# EAGLE design PN532NFCExtAnt (EAGLE 7.7.0)
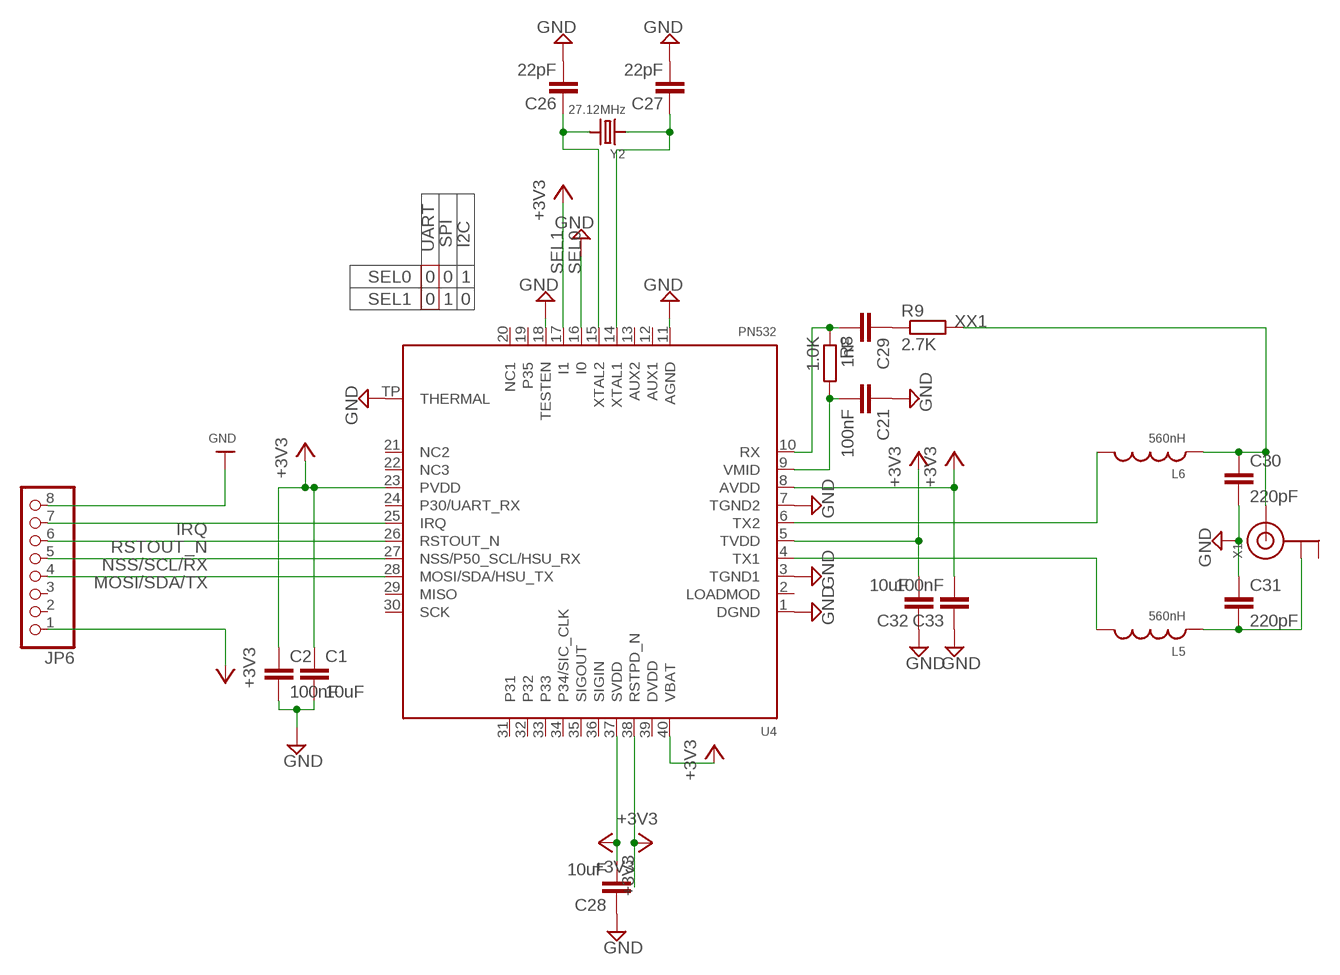
[diagram p0: schematic, sheet 1]

## Parts
C1  10uF  C-EUC0805  [C0805]
C2  100nF  C-EUC0805  [C0805]
C21  100nF  C-EUC0603  [C0603]
C26  22pF  CAP0603-CAP  [0603-CAP]
C27  22pF  CAP0603-CAP  [0603-CAP]
C28  10uF  C-EUC0805  [C0805]
C29  1nF  C-EUC0603  [C0603]
C30  220pF  C-EUC0603  [C0603]
C31  220pF  C-EUC0603  [C0603]
C32  10uF  C-EUC0805  [C0805]
C33  100nF  C-EUC0805  [C0805]
JP6  HEADER-1X8ROUND  [1X08_ROUND]
L5  560nH  INDUCTOR0805  [0805@1]
L6  560nH  INDUCTOR0805  [0805@1]
R8  1.0K  R-EU_R0603  [R0603]
R9  2.7K  R-EU_R0603  [R0603]
U4  PN532  [HVQFN40-6X6]
X1  ANTENNA_U.FL  [U.FL]
Y2  27.12MHz  CRYSTALTHIN  [CRYSTAL_3.2X2.5]

## Nets
+3V3: C1.1 C2.1 C28.2 C32.2 C33.2 JP6.1 U4.5(TVDD) U4.8(AVDD) U4.23(PVDD) U4.37(SVDD) U4.38(RSTPD_N) U4.40(VBAT)
CON1: C31.2 L5.1 X1.1(GND)
GND: C1.2 C2.2 C21.1 C26.1 C27.1 C28.1 C30.2 C31.1 C32.1 C33.1 JP6.8 U4.1(DGND) U4.3(TGND1) U4.7(TGND2) U4.11(AGND) U4.18(TESTEN) U4.TP(THERMAL)
IRQ: JP6.7
MOSI/SDA/TX: JP6.4
N$6: L5.2 U4.4(TX1)
N$15: L6.2 U4.6(TX2)
N$16: C29.1 R9.1
N$47: C27.2 U4.14(XTAL1) Y2.1
N$48: C26.2 U4.15(XTAL2) Y2.2
N$49: C21.2 R8.2 U4.9(VMID)
N$50: C29.2 R8.1 U4.10(RX)
NSS/SCL/RX: JP6.5
RSTOUT_N: JP6.6
SEL0: U4.16(I0) ; supply symbol labelled GND
SEL1: U4.17(I1)
XX1: C30.1 L6.1 R9.2 X1.3(SIGNAL)
Unconnected: JP6.2 JP6.3 U4.2(LOADMOD) U4.12(AUX1) U4.13(AUX2) U4.19(P35) U4.20(NC1) U4.21(NC2) U4.22(NC3) U4.24(P30/UART_RX) U4.25(IRQ) U4.26(RSTOUT_N) U4.27(NSS/P50_SCL/HSU_RX) U4.28(MOSI/SDA/HSU_TX) U4.29(MISO) U4.30(SCK) U4.31 U4.32 U4.33 U4.34(P34/SIC_CLK) U4.35(SIGOUT) U4.36(SIGIN) U4.39(DVDD) X1.2(GND)

## Notes on the sheet
- UART | SPI | I2C
- SEL0 | 0 | 0 | 1
- SEL1 | 0 | 1 | 0

## Library data of the parts
C1 C2 C21 C28-C33 = rcl:C-EU: CAPACITOR, European symbol
C26 C27 = SparkFun:CAP: Capacitor Standard 0603 ceramic capacitor, and 0.1" leaded capacitor.
JP6 = microbuilder:HEADER-1X8: PIN HEADER
L5 L6 = microbuilder:INDUCTOR: Inductors 0603: 10nH Ceramic Inductor - microwire antenna/RF (Digikey: 712-1434-2-ND) 0805: 560nH Ceramic Inductor - RF (Digikey: 553-1047-1-ND) 1007 (2518 Metric) SMT: 10µH 10% 250mOhm 820mA 1007 Inductor (Digikey: 587-2189-1-ND) 22µH 10% 500mOhm 580mA 1007 Inductor (Digikey: 587-2190-1-ND) 47µH 10% 950mOhm 420mA 1007 Inductor (Digikey: 587-2191-1-ND) 47µH 5% 100mOhm 1A 1008 Inductor (Digikey: 732-1816-1-ND)
R8 R9 = rcl:R-EU_: RESISTOR, European symbol
U4 = microbuilder:PN532: PN532 - Near Field Communication (NFC) controller Highly integrated transceiver module for contactless communication at 13.56 MHz (14443A/MIFARE, FeliCa, I4443B)
X1 = adafruit:ANTENNA_U.FL: U.FL Antenna Connector
Y2 = microbuilder:CRYSTAL: Crystals HC49UP - Surface Mount Crystal 4.0MHz 18pF +/-30ppm Surface Mount Crystal [Digikey: 535-9857-1-ND] 12.0 MHz Surface Mount Crystal [Digikey: 535-9869-6-ND] 25.0 MHz Surface Mount Crystal [Digikey: 535-9078-1-ND] 3.2 x 2.5mm - MEMs SMT Crystal 12.0 MHz 8pF 15ppm 3.2 x 2.5mm Crystal [Digikey: 644-1047-1-ND] 16.0 MHz 8pF 15ppm 3.2 x 2.5mm Crystal [Digikey: 644-1049-1-ND] 16.0 MHz 10pF 10ppm 3.2 x 2.5mm Crystal [Digikey: 644-1100-1-ND] 27.12 MHz 18pF 30ppm 3.2 x 2.5mm Crystal [Digikey: 887-1424-1-ND] 4.9 x 1.8mm - MEMs SMT Crystal 32.768 KHz 12.5pF 20ppm 4.9 x 1.8mm Crystal [Digikey: SE2415CT-ND] Cylinder 32.768KHz Cylinder Crystal

## Net classes
1 Ground: width 0.61 mm, clearance 0.254 mm

## Board
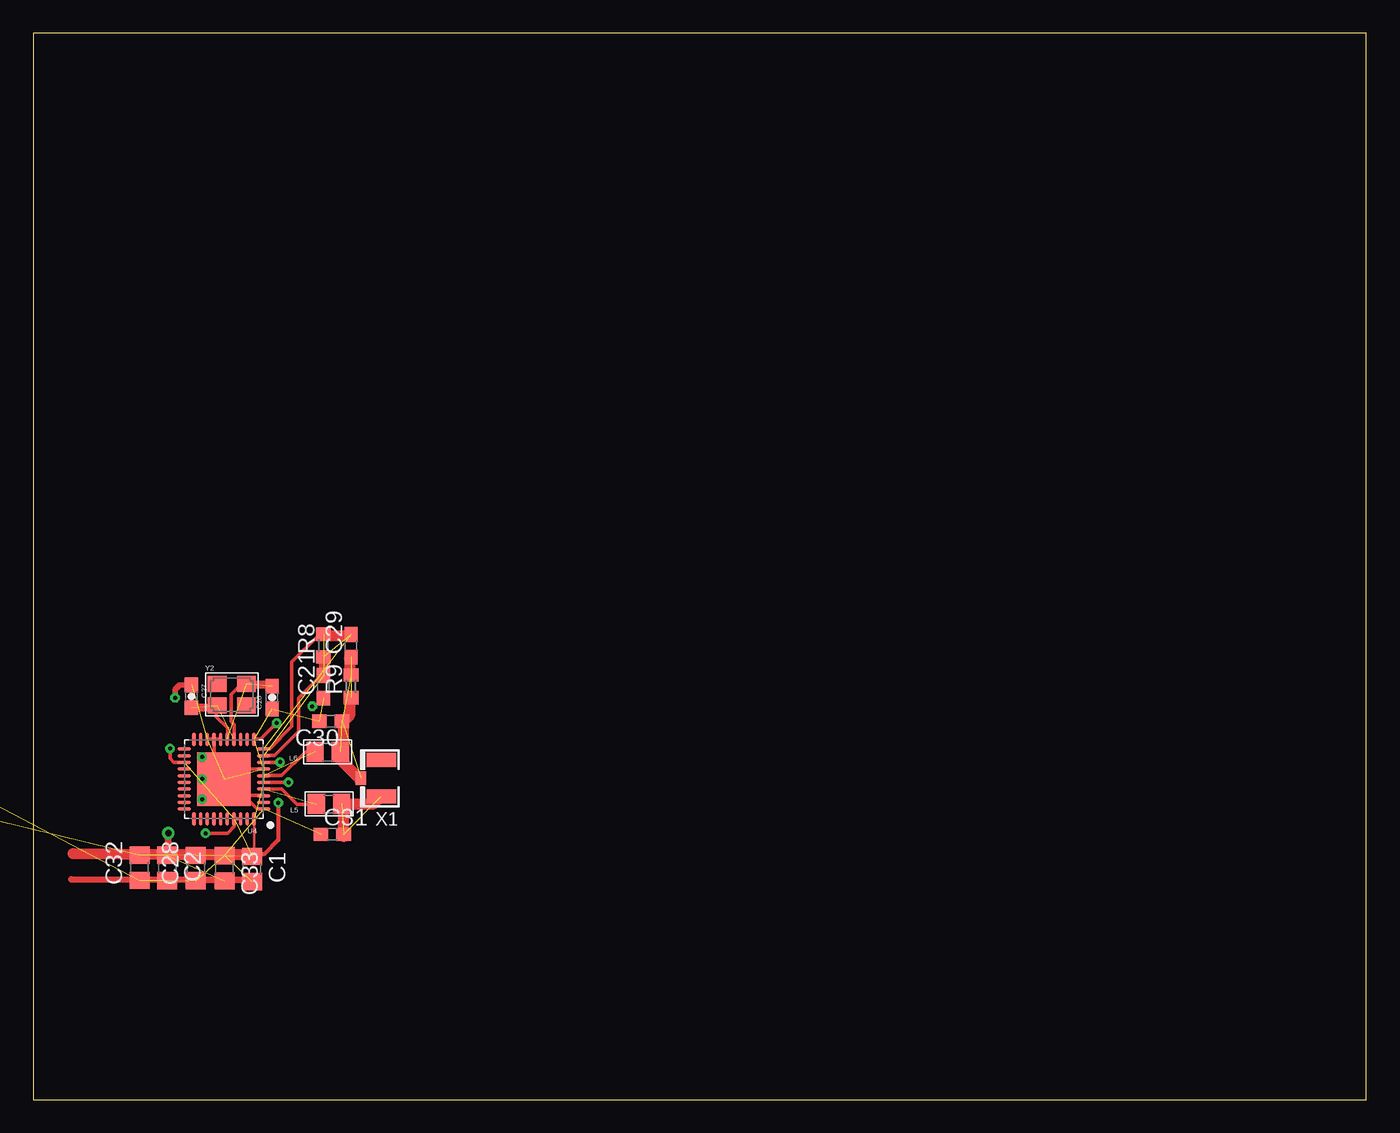
[diagram p1: board, top side]
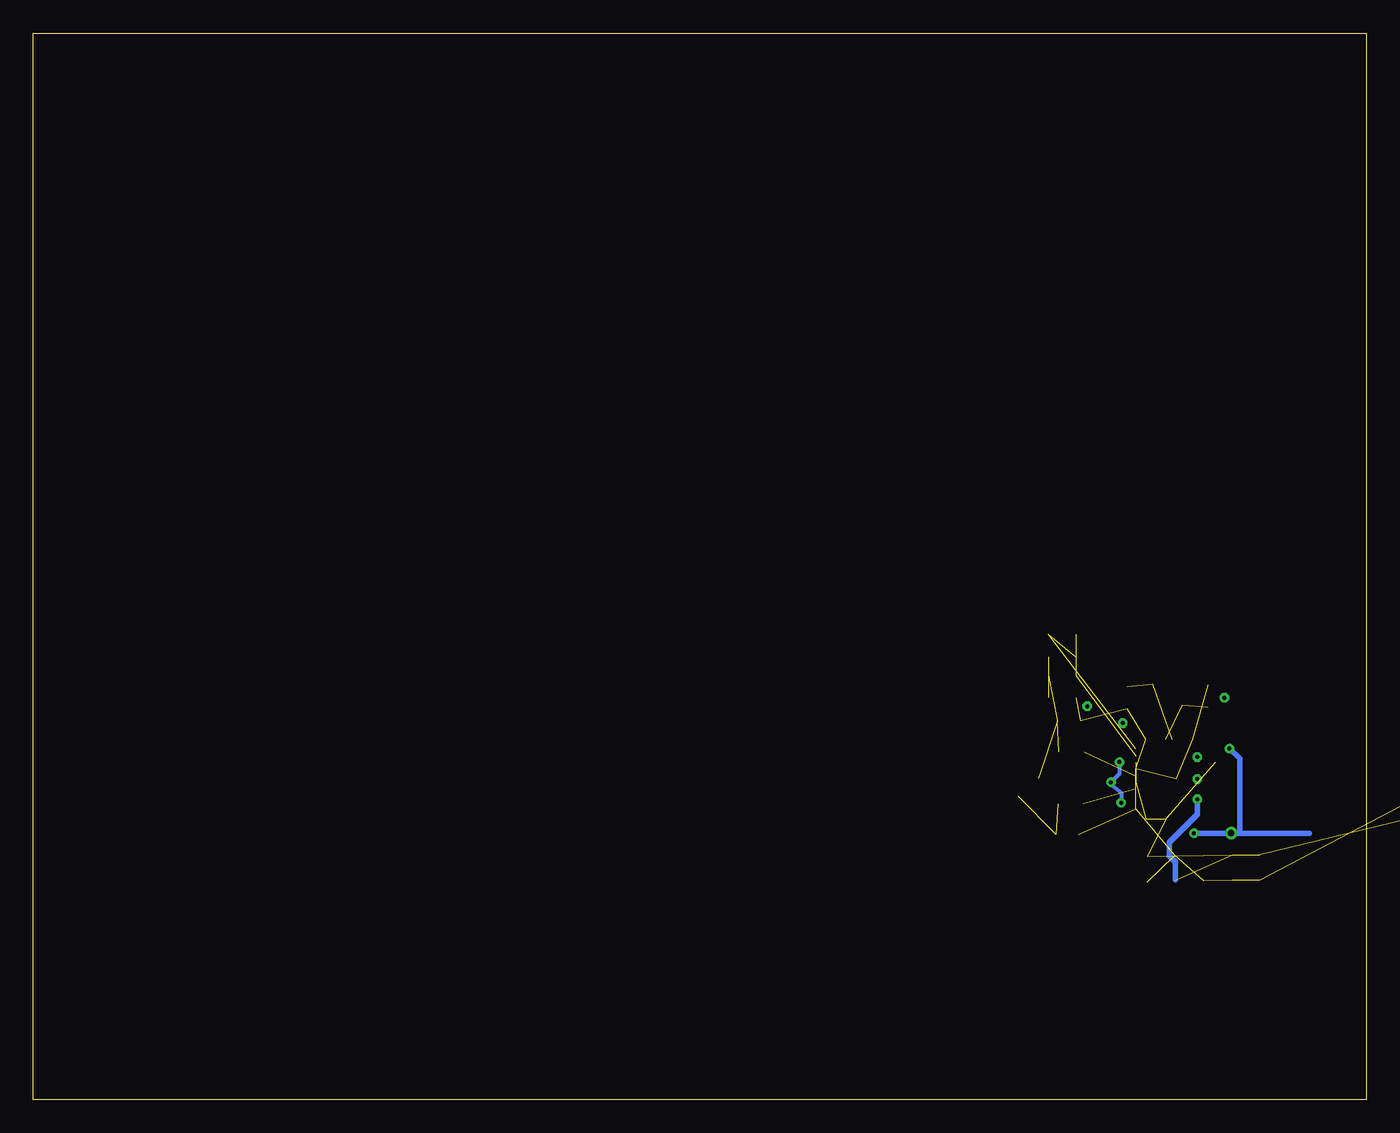
[diagram p2: board, bottom side, seen from below]

Size 100 x 80 mm. Coordinates in mm from the lower left corner, seen from the top.
Outline: 0,0 100,0 100,80 0,80 0,0
Copper layers (1*16): Top 0.035mm / dielectric 1.5mm / Bottom 0.035mm
Design rules "default": minimum track width 10mil, minimum drill 24mil, track to track 8mil, track to pad 8mil, pad to pad 8mil, via to via 8mil, smd to smd 8mil, copper to edge 40mil, drill to drill 8mil, minimum pad ring 10mil, minimum via ring 8mil, stop-mask expansion 4mil, vias tented up to drill 0mil, thermal gap 10mil

### Footprints (pad centres in the part's own frame; a part is rotated, then mirrored left to right if it is on the bottom)
C0805 = smd 1.3 x 1.5: 1 -0.95,0; 2 0.95,0
C0603 = smd 1.1 x 1: 1 -0.85,0; 2 0.85,0
0603-CAP = smd 1.1 x 1: 1 -0.85,0; 2 0.85,0
1X08_ROUND = drill 1 pad 1.676: 1 -8.89,0; 2 -6.35,0; 3 -3.81,0; 4 -1.27,0; 5 1.27,0; 6 3.81,0; 7 6.35,0; 8 8.89,0
0805@1 = smd 1.3 x 1.5: 1 -0.95,0; 2 0.95,0
R0603 = smd 1 x 1.1: 1 -0.85,0; 2 0.85,0
HVQFN40-6X6 = smd 1 x 0.25: 1 -2.99,2.25; 2 -2.99,1.75; 3 -2.99,1.25; 4 -2.99,0.75; 5 -2.99,0.25; 6 -2.99,-0.25; 7 -2.99,-0.75; 8 -2.99,-1.25; 9 -2.99,-1.75; 10 -2.99,-2.25; 21 2.99,-2.25; 22 2.99,-1.75; 23 2.99,-1.25; 24 2.99,-0.75; 25 2.99,-0.25; 26 2.99,0.25; 27 2.99,0.75; 28 2.99,1.25; 29 2.99,1.75; 30 2.99,2.25 | smd 0.25 x 1: 11 -2.25,-2.99; 12 -1.75,-2.99; 13 -1.25,-2.99; 14 -0.75,-2.99; 15 -0.25,-2.99; 16 0.25,-2.99; 17 0.75,-2.99; 18 1.25,-2.99; 19 1.75,-2.99; 20 2.25,-2.99; 31 2.25,2.99; 32 1.75,2.99; 33 1.25,2.99; 34 0.75,2.99; 35 0.25,2.99; 36 -0.25,2.99; 37 -0.75,2.99; 38 -1.25,2.99; 39 -1.75,2.99; 40 -2.25,2.99 | smd 4 x 4: TP 0,0
U.FL = smd 2.2 x 1.05: 1 0,1.375; 2 0,-1.375 | smd 0.8 x 1: 3 1.525,0
CRYSTAL_3.2X2.5 = smd 1.4 x 1.2: 1 -1.1,-0.8; 2 1.1,0.8; GND1 -1.1,0.8; GND2 1.1,-0.8

### Placement (x,y rotation side)
C1  16.41,17.29 270 top
C2  10.05,17.38 270 top
C21  21.77,30.97 90 top
C26  17.91,30.16 90 top
C27  11.87,30.25 270 top
C28  12.2,17.38 90 top
C29  23.84,34.05 90 top
C30  22.31,28.4 180 top
C31  22.43,19.89 0 top
C32  7.97,17.39 90 top
C33  14.34,17.36 270 top
JP6  -22.86,27.94 0 top  (outside the outline)
L5  22.18,22.16 180 top
L6  22.09,26.07 180 top
R8  21.77,34.05 90 top
R9  23.84,31 90 top
U4  14.3,24.04 180 top
X1  26.11,24.11 180 top
Y2  14.89,30.39 0 top

### Tracks (layer width: path | path; a pad name or v marks a point on that pad's centre or on a via)
+3V1  (via drill 0.3, 0.5)
  Top 0.2: 16.61,18.4 16.57,18.18 16.57,21.06
  Top 0.254: 11.32,25.3 10.53,25.3 10.26,25.58 v10.26,26.34 | v12.92,19.99 14.57,19.99 15.07,20.48 15.07,21.06 15.57,21.06 | 17.3,23.8 v19.14,23.8 | 17.3,25.3 18.62,25.3 v18.51,25.32
  Top 0.305: v18.38,22.27 18.38,19.48 17.3,18.4 16.61,18.4 | v19.14,23.8 19.27,23.8 | 2.88,18.46 2.98,18.46
  Top 0.5: v10.13,19.99 10.13,18.4
  Top 0.813: 2.98,18.46 10.13,18.4 16.61,18.4
  Bottom 0.305: v18.38,22.27 18.38,23.04 19.02,23.54 19.27,23.8 v19.14,23.8 18.51,24.43 v18.51,25.32
  Bottom 0.406: 4.29,19.99 9.49,19.99 | 9.49,19.99 v10.13,19.99 v12.92,19.99 | v10.26,26.34 9.49,25.58 9.49,19.99
+3V3  (11 unrouted)
CON1  (2 unrouted)
CON2
  Top 0.813: 26,22.68 25.47,22.15 23.02,22.15 23.3,21.87 23.3,19.73
GND  (16 unrouted)
GND1  (via drill 0.3)
  Top 0.254: 17.3,22.8 15.78,22.8 | 15.78,22.8 15.57,22.8 14.32,24.05 | 17.3,24.8 15.07,24.8 14.32,24.05 | 13.57,27.04 13.57,24.8 14.32,24.05 | 13.07,27.04 13.57,27.04 | 16.57,27.04 17.05,27.04 v18.26,28.24 | 17.3,21.8 16.78,21.8 15.78,22.8 | 13.57,27.04 14.07,27.04
  Top 0.406: 11.78,31.12 10.98,31.12 10.64,30.78 v10.64,30.15
  Top 0.5: 16.61,16.5 12.03,16.5 2.83,16.53
  Bottom 0.406: 12.67,22.4 12.67,21.38 14.76,19.29 14.76,18.27 14.32,17.83 14.32,16.5
  other vias: 12.67,25.7 12.67,24.05 20.92,29.51 12.67,22.53
N$1
  Top 0.254: 15.07,27.04 15.07,28.13 14.83,28.37 14.83,30.4 15.5,31.07 15.93,31.07
  Top 0.61: 17.88,31.12 15.98,31.12 15.93,31.07
N$2
  Top 0.254: 14.57,27.04 14.57,27.87 13.73,28.71 13.73,29.47
  Top 0.61: 11.78,29.42 13.68,29.42 13.73,29.47
N$3
  Top 0.254: 17.3,25.8 18.1,25.8 19.91,27.61 19.91,30.15 21.52,31.76 21.81,31.76
  Top 0.813: 21.81,33.11 21.81,31.76
N$4
  Top 0.254: 21.81,34.81 21.39,34.81 19.4,32.81 19.4,27.99 17.71,26.3 17.3,26.3
  Top 0.813: 21.81,34.81 23.72,34.81
N$6  (1 unrouted)
N$8
  Top 0.813: 23.72,33.11 23.72,31.76
N$9
  Top 0.254: 17.3,23.3 18.62,23.3 19.78,22.15 21.12,22.15
N$10
  Top 0.254: 17.3,24.3 18.63,24.3 20.42,26.08 21.12,26.08
N$15  (1 unrouted)
N$16  (1 unrouted)
N$47  (2 unrouted)
N$48  (2 unrouted)
N$49  (2 unrouted)
N$50  (2 unrouted)
XX1  (3 unrouted)
XX2
  Top 0.813: 24.48,24.05 23.02,25.51 23.02,26.08 23.3,26.36 23.3,28.37 23.72,28.79 23.72,30.06